# EAGLE schematic AS3364 quad mixer 0402 DIL-inv v1.0 (EAGLE 9.6.2)
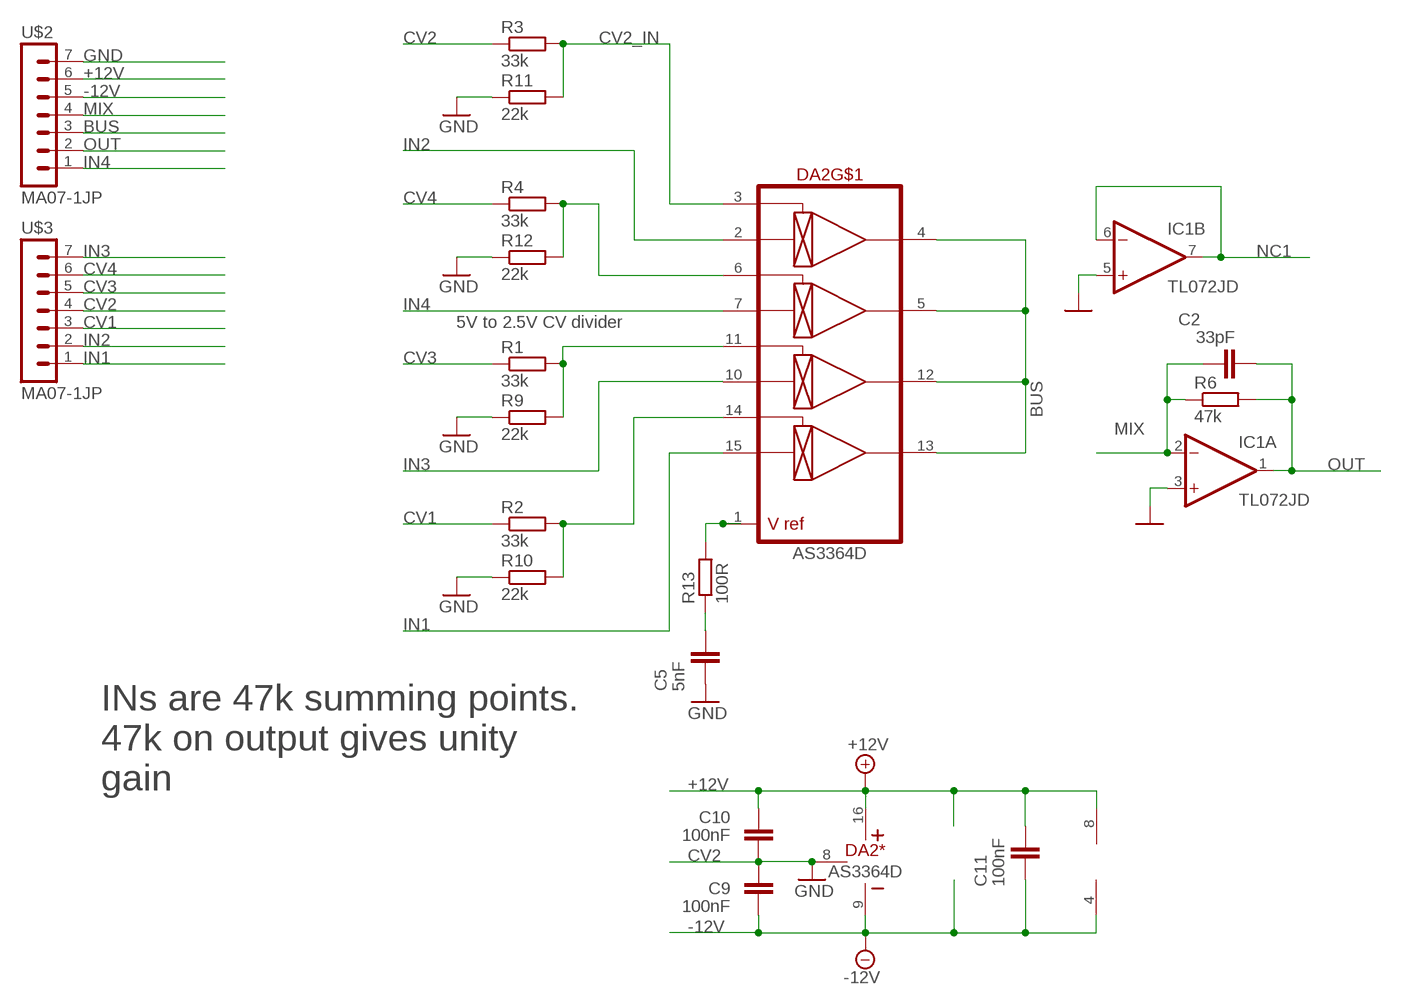
[diagram p0: schematic, sheet 1]

## Parts
C2  33pF  C-EUC0402  [C0402]
C5  5nF  C-EUC0402  [C0402]
C9  100nF  C-EUC0402  [C0402]
C10  100nF  C-EUC0402  [C0402]
C11  100nF  C-EUC0402  [C0402]
DA2  AS3364D  [DIL16J]
IC1  TL072JD  [SO08J]
R1  33k  R-EU_R0402  [R0402]
R2  33k  R-EU_R0402  [R0402]
R3  33k  R-EU_R0402  [R0402]
R4  33k  R-EU_R0402  [R0402]
R6  47k  R-EU_R0402  [R0402]
R9  22k  R-EU_R0402  [R0402]
R10  22k  R-EU_R0402  [R0402]
R11  22k  R-EU_R0402  [R0402]
R12  22k  R-EU_R0402  [R0402]
R13  100R  R-EU_R0402  [R0402]
U$2  MA07-1JP  [SIP-PIN07-1J]
U$3  MA07-1JP  [SIP-PIN07-1J]

## Nets
+12V: C10.2 C11.2 DA2.16(*:V+) IC1.8(P:V+) U$2.6
-12V: C9.1 C11.1 DA2.9(*:V-) IC1.4(P:V-) U$2.5
BUS: DA2.4(OUT1) DA2.5(OUT2) DA2.12(OUT3) DA2.13(OUT4) U$2.3
CV1: R2.1 U$3.3
CV2: R3.1 U$3.4
CV2_IN: DA2.3(CV1) R3.2 R11.2
CV3: R1.1 U$3.5
CV4: R4.1 U$3.6
GND: C5.1 C9.2 C10.1 DA2.8(*:GND) IC1.3(A:+IN) IC1.5(B:+IN) R9.1 R10.1 R11.1 R12.1 U$2.7
IN1: DA2.15(IN4) U$3.1
IN2: DA2.2(IN1) U$3.2
IN3: DA2.10(IN3) U$3.7
IN4: DA2.7(IN2) U$2.1
MIX: C2.1 IC1.2(A:-IN) R6.1 U$2.4
N$2: DA2.1(VREF) R13.2
N$10: DA2.6(CV2) R4.2 R12.2
N$12: DA2.11(CV3) R1.2 R9.2
N$14: C5.2 R13.1
N$21: DA2.14(CV4) R2.2 R10.2
NC1: IC1.6(B:-IN) IC1.7(B:OUT)
OUT: C2.2 IC1.1(A:OUT) R6.2 U$2.2

## Notes on the sheet
- 5V to 2.5V CV divider
- INs are 47k summing points.
  47k on output gives unity
  gain

## Library data of the parts
C2 C5 C9-C11 = rcl:C-EU: CAPACITOR, European symbol; SPICEPREFIX: C
DA2 = joakim:AS3364: AS3364 quad linear VCA, CEM3360 style. CV is 0 to 2V Vcc-Vee = 26V max, so +/-12V or +15V/-9V
IC1 = joakim:TL072J: OP AMP
R1-R4 R6 R9-R13 = rcl:R-EU_: RESISTOR, European symbol; SPICEPREFIX: R
U$2 U$3 = joakim:MA07-1J